# Altium schematic sheet robot-arm2.SchDoc
size A; SheetNumber: 2; SheetTotal: 2
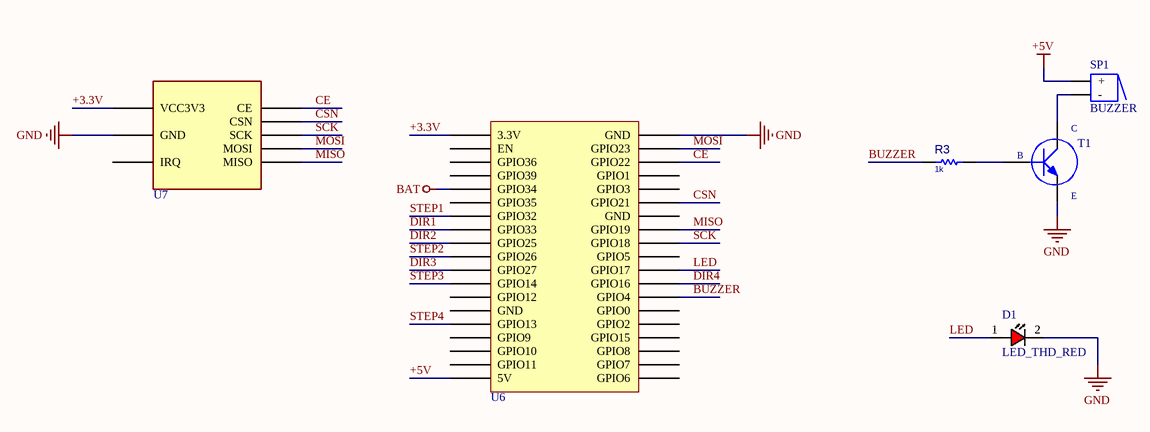
[diagram p0: robot-arm2.SchDoc]

## Parts
D1  LED_THD_RED  [LED5MM_RED]
R3  1k  [R025W_AX04]
SP1  BUZZER  [BUZZER 7.62 mm DC]
T1  NPN  [TO-92]  (value not drawn)
U6  (no value)  [NODEMCU_ESP32]
U7  NRF24L01_MS  [NRF24L01_H]  (value not drawn)

## Nets
+5V: SP1.1(+) U6.19(5V)
BAT: U6.5(GPIO34)
GND: D1.2(CATHODE) T1.3(E) U6.38(GND) U7.1(GND)
+3.3V: U6.1(3.3V) U7.2(VCC3V3)
BUZZER: R3.1 U6.26(GPIO4)
CE: U6.36(GPIO22) U7.3(CE)
CSN: U6.33(GPIO21) U7.4(CSN)
DIR1: U6.8(GPIO33)
DIR2: U6.9(GPIO25)
DIR3: U6.11(GPIO27)
DIR4: U6.27(GPIO16)
LED: D1.1(ANODE) U6.28(GPIO17)
MISO: U6.31(GPIO19) U7.7(MISO)
MOSI: U6.37(GPIO23) U7.6(MOSI)
SCK: U6.30(GPIO18) U7.5(SCK)
STEP1: U6.7(GPIO32)
STEP2: U6.10(GPIO26)
STEP3: U6.12(GPIO14)
STEP4: U6.15(GPIO13)
NetR3_2: R3.2 T1.2(B)
NetSP1_2: SP1.2(-) T1.1(C)

Not connected (* = marked no-connect by the designer): U6 2(EN) 3(GPIO36) 4(GPIO39) 6(GPIO35) 13(GPIO12) 14(GND) 16(GPIO9) 17(GPIO10) 18(GPIO11) 20(GPIO6) 21(GPIO7) 22(GPIO8) 23(GPIO15) 24(GPIO2) 25(GPIO0) 29(GPIO5) 32(GND) 34(GPIO3) 35(GPIO1); U7 8(IRQ)

## Library data of the parts
D1 = LED_THD_RED: LED, THD, RED; PARAM: *; MANF: *; ASSEMBLY: *; PRICE: *; DESC: *; MANF_P#: *; PARAM2: *; VALUE: *
R3 = RES_THD: RESISTOR, THD; MANF_P#: RK73H1ETTP4701F; MANF: KOA SPEER; PARAM: 0.063W; DESC: DESCRIPTION; DIST#: MOUSER; PARAM2: 1%; ASSEMBLY: ASSEMBLY; PRICE: 100= 0.5$; VALUE: 1k
T1 = BC547
U6 = NODEMCU - ESP32S: ESP32S
U7 = NRF24L01_MS: 2.4GHz Transceiver MODULE, SMD